# EAGLE design fridge (EAGLE 7.7.0)
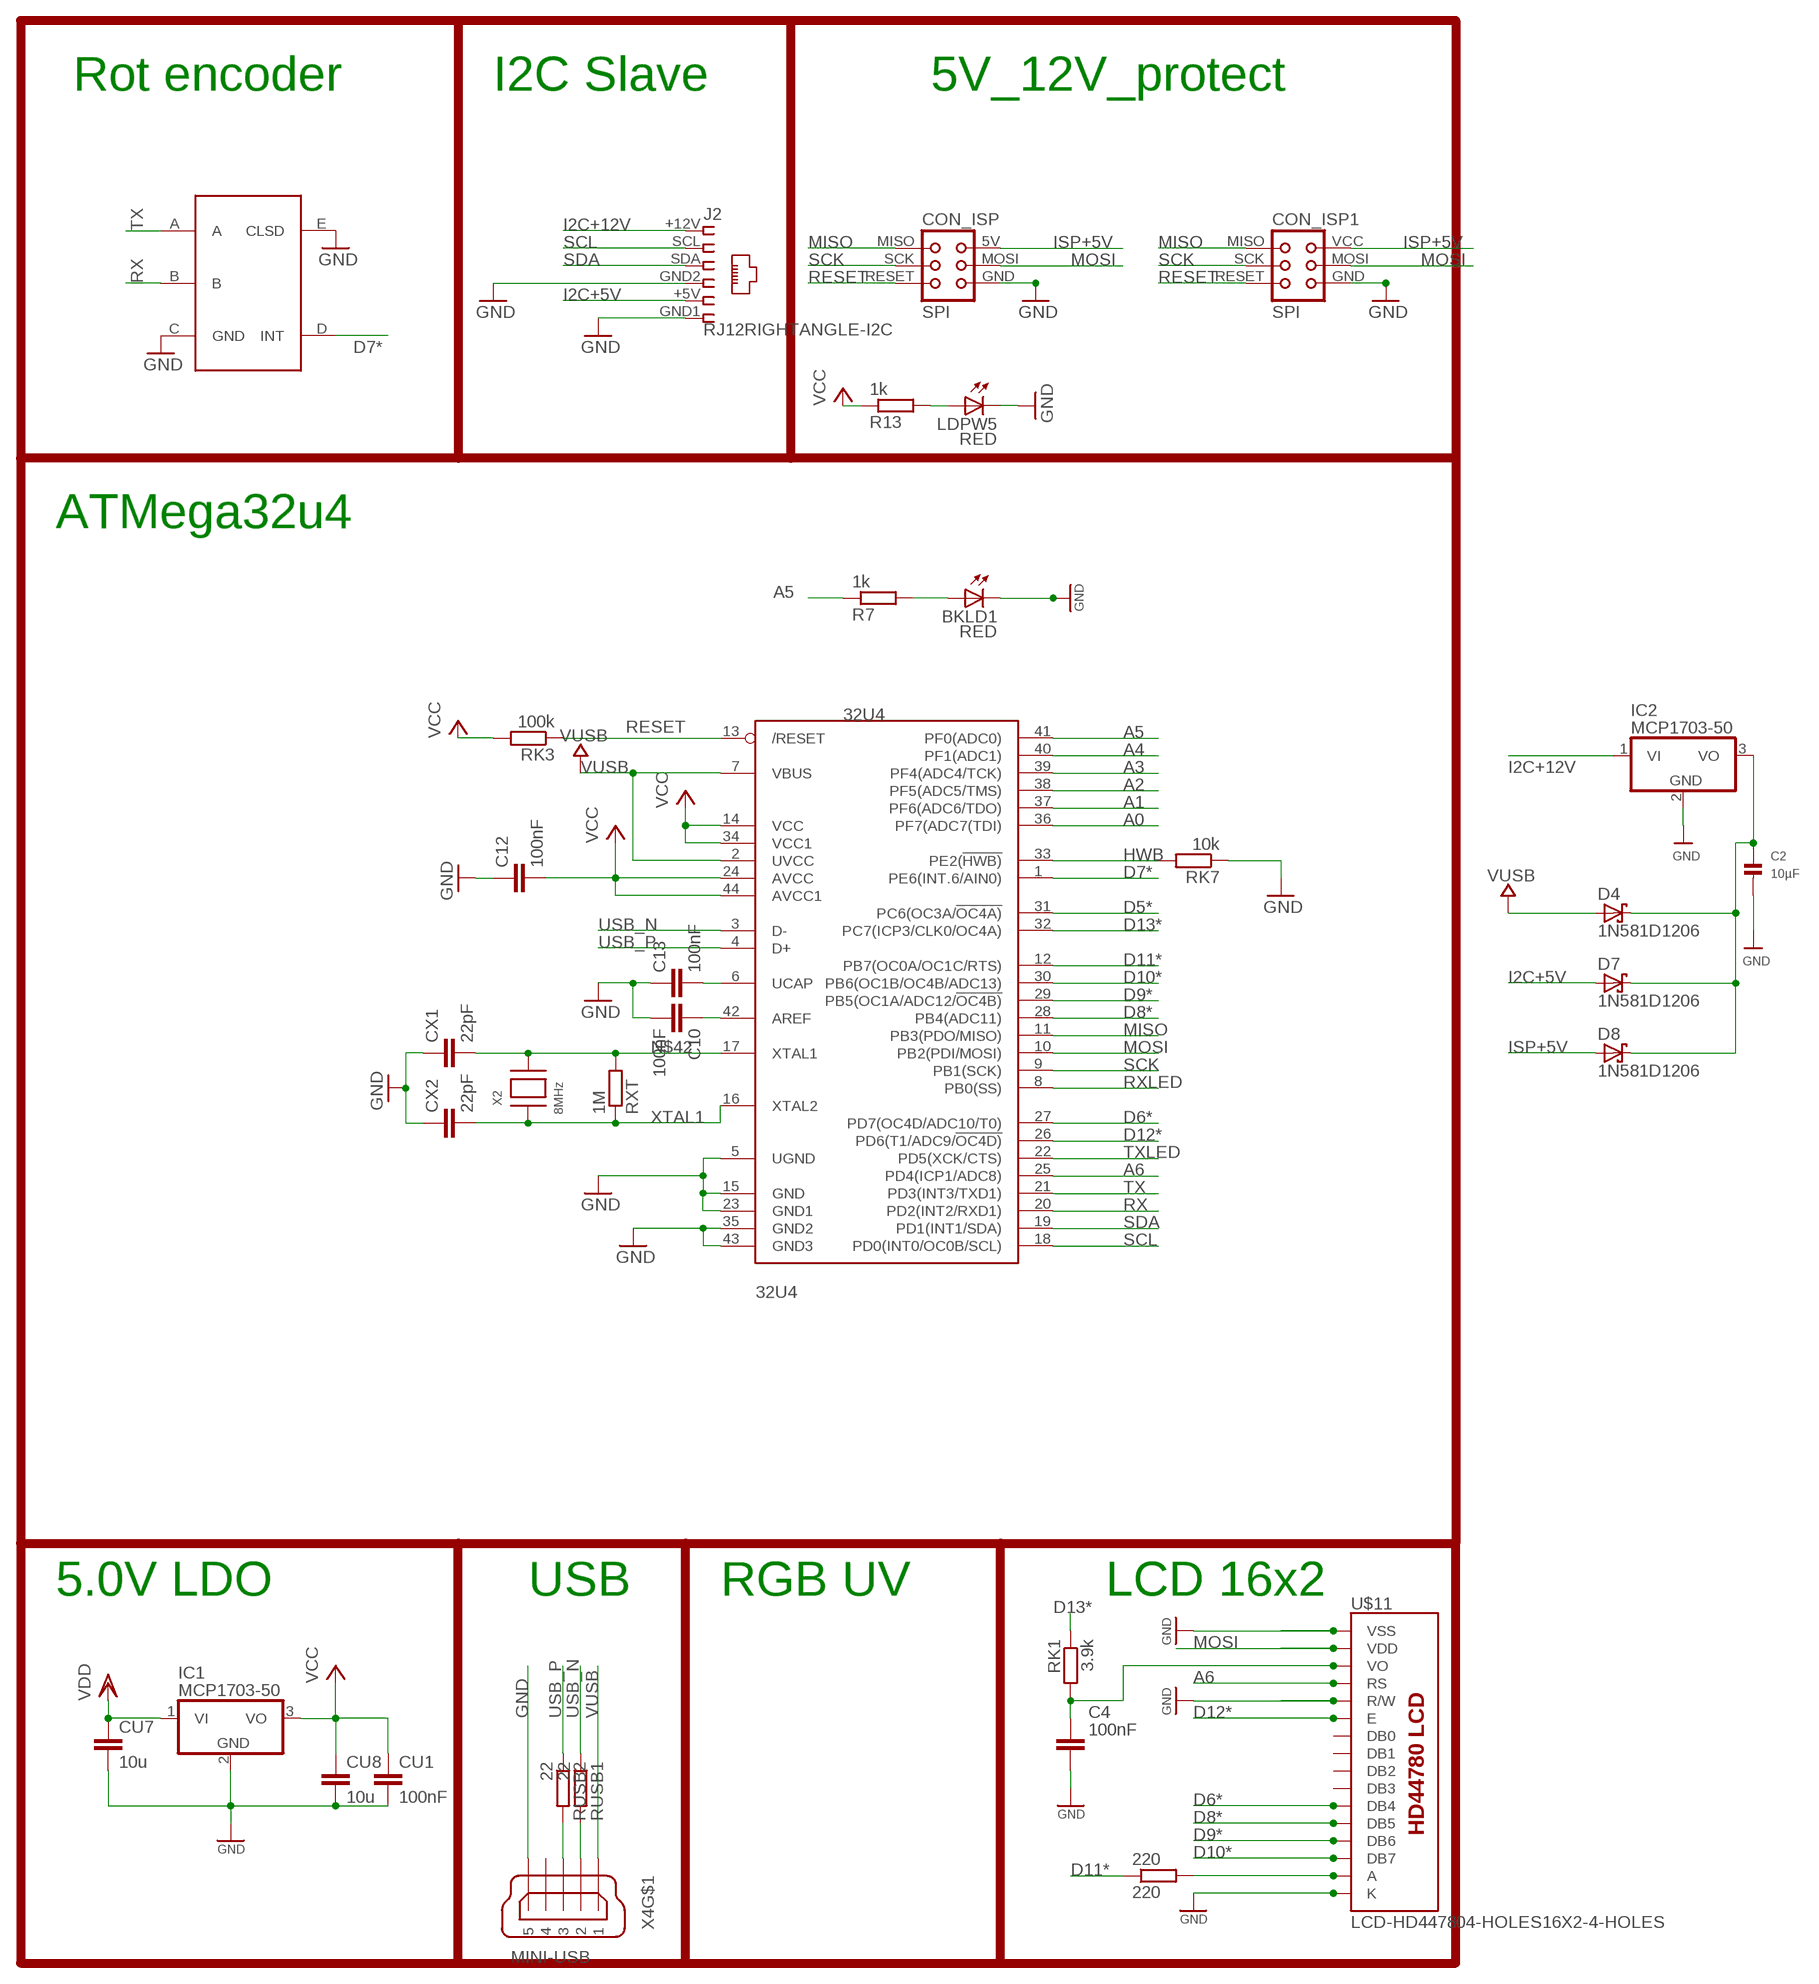
[diagram p0: schematic, sheet 1]

## Parts
32U4  32U4  ATMEGA32U4-AU  [TQFP44]
220  220  R-EU_R0805  [R0805]
BKLD1  RED  LEDCHIP-LED0805  [CHIP-LED0805]
C2  10µF  CAP_CERAMIC0805  [0805]
C4  100nF  CAPACITOR_NPOL-0805  [C805]
C10  100nF  C-EUC1206  [C1206]
C12  100nF  C-EUC1206  [C1206]
C13  100nF  C-EUC1206  [C1206]
CON_ISP  SPI  TINYISPT  [TC2030-MCP-NL]
CON_ISP1  SPI  TINYISP  [TINYISP]
CU1  100nF  C-EUC0805  [C0805]
CU7  10u  C-EUC0805  [C0805]
CU8  10u  C-EUC0805  [C0805]
CX1  22pF  C-EUC1206  [C1206]
CX2  22pF  C-EUC1206  [C1206]
D4  1N581D1206  [LED-1206]
D7  1N581D1206  [LED-1206]
D8  1N581D1206  [LED-1206]
IC1  MCP1703-50  MCP1703DB  [SOT223]
IC2  MCP1703-50  MCP1703DB  [SOT223]
J2  RJ12RIGHTANGLE-I2C  [RJ12-RIGHTANGLE-I2C]
LDPW5  RED  LEDCHIP-LED0805  [CHIP-LED0805]
R7  1k  R-EU_R0805  [R0805]
R13  1k  R-EU_R0805  [R0805]
RK1  3.9k  R-EU_R0805  [R0805]
RK3  100k  R-EU_M0805  [M0805]
RK7  10k  R-EU_M0805  [M0805]
RUSB1  22  R-EU_M1206  [M1206]
RUSB2  22  R-EU_M1206  [M1206]
RXT  1M  R-EU_R0805  [R0805]
U$1  EC11E  [EC11E]
U$11  LCD-HD447804-HOLES16X2-4-HOLES  [LCD-16X2-4HOLES]
X2  8MHz  XTALNX6035  [NX6035]
X4  MINI-USB  MINI-USB-SCHIELD-32005-201  [32005-201]

## Nets
A0: 32U4.36(PF7(ADC7(TDI))
A1: 32U4.37(PF6(ADC6/TDO))
A2: 32U4.38(PF5(ADC5/TMS))
A3: 32U4.39(PF4(ADC4/TCK))
A4: 32U4.40(PF1(ADC1))
A5: 32U4.41(PF0(ADC0)) R7.1
A6: 32U4.25(PD4(ICP1/ADC8)) U$11.4(RS)
AREF: 32U4.42(AREF) C10.1
D5*: 32U4.31(PC6(OC3A/!OC4A))
D6*: 32U4.27(PD7(OC4D/ADC10/T0)) U$11.11(DB4)
D7*: 32U4.1(PE6(INT.6/AIN0)) U$1.D(INT)
D8*: 32U4.28(PB4(ADC11)) U$11.12(DB5)
D9*: 32U4.29(PB5(OC1A/ADC12/!OC4B)) U$11.13(DB6)
D10*: 32U4.30(PB6(OC1B/OC4B/ADC13)) U$11.14(DB7)
D11*: 32U4.12(PB7(OC0A/OC1C/RTS)) 220.1
D12*: 32U4.26(PD6(T1/ADC9/!OC4D)) U$11.6(E)
D13*: 32U4.32(PC7(ICP3/CLK0/OC4A)) RK1.1
GND [power]: 32U4.5(UGND) 32U4.15(GND) 32U4.23(GND1) 32U4.35(GND2) 32U4.43(GND3) BKLD1.C C2.2 C4.2 C10.2 C12.1 C13.1 CON_ISP1.GND CON_ISP.GND CU1.2 CU7.2 CU8.2 CX1.1 CX2.1 IC1.2(GND) IC2.2(GND) J2.GND1 J2.GND2 LDPW5.C RK7.1 U$1.C(GND) U$1.E(CLSD) U$11.1(VSS) U$11.5(R/W) U$11.16(K) X4.5
HWB: 32U4.33(PE2(!HWB)) RK7.2
I2C+5V: D7.A J2.+5V
I2C+12V [power]: IC2.1(VI) J2.+12V
ISP+5V: CON_ISP1.VCC CON_ISP.5V(VCC) D8.A
MISO: 32U4.11(PB3(PDO/MISO)) CON_ISP1.MISO CON_ISP.MISO
MOSI: 32U4.10(PB2(PDI/MOSI)) CON_ISP1.MOSI CON_ISP.MOSI U$11.2(VDD)
N$1: 32U4.6(UCAP) C13.2
N$2: C4.1 RK1.2 U$11.3(VO)
N$11: 220.2 U$11.15(A)
N$12: LDPW5.A R13.2
N$14: BKLD1.A R7.2
N$19: C2.1 D4.C D7.C D8.C IC2.3(VO)
N$42: 32U4.17(XTAL1) CX1.2 RXT.2 X2.P$2
RESET: 32U4.13(/RESET) CON_ISP1.RESET CON_ISP.RESET RK3.1
RX: 32U4.20(PD2(INT2/RXD1)) U$1.B
RXLED: 32U4.8(PB0(SS))
SCK: 32U4.9(PB1(SCK)) CON_ISP1.SCK CON_ISP.SCK
SCL: 32U4.18(PD0(INT0/OC0B/SCL)) J2.SCL
SDA: 32U4.19(PD1(INT1/SDA)) J2.SDA
TX: 32U4.21(PD3(INT3/TXD1)) U$1.A
TXLED: 32U4.22(PD5(XCK/CTS))
USB_N: 32U4.3(D-) RUSB1.1
USB_P: 32U4.4(D+) RUSB2.1
USBC_N: RUSB1.2 X4.2
USBC_P: RUSB2.2 X4.3
VCC: 32U4.14(VCC) 32U4.24(AVCC) 32U4.34(VCC1) 32U4.44(AVCC1) C12.2 CU1.1 CU8.1 IC1.3(VO) R13.1 RK3.2
VDD [power]: CU7.1 IC1.1(VI)
VUSB: 32U4.2(UVCC) 32U4.7(VBUS) D4.A X4.1
XTAL1: 32U4.16(XTAL2) CX2.2 RXT.1 X2.P$1
Unconnected: U$11.7(DB0) U$11.8(DB1) U$11.9(DB2) U$11.10(DB3) X4.4 X4.M1(S:S1) X4.M2(S:S2) X4.M3(S:S3) X4.M4(S:S4)

## Notes on the sheet
- Rot encoder | I2C Slave | 5V_12V_protect
- ATMega32u4
- 5.0V LDO | USB | RGB UV | LCD 16x2

## Library data of the parts
32U4 = adafruit:ATMEGA32U4: http://www.ladyada.net/library/eagle
220 R7 RK1 RXT = rcl:R-EU_: RESISTOR, European symbol
BKLD1 LDPW5 = adafruit:LED: LED OSRAM: - CHIPLED LG R971, LG N971, LY N971, LG Q971, LY Q971, LO R971, LY R971 LH N974, LH R974 LS Q976, LO Q976, LY Q976 LO Q996 - Hyper CHIPLED LW Q18S LB Q993, LB Q99A, LB R99A - SideLED LS A670, LO A670, LY A670, LG A670, LP A670 LB A673, LV A673, LT A673, LW A673 LH A674 LY A675 LS A676, LA A676, LO A676, LY A676, LW A676 LS A679, LY A679, LG A679 - Hyper Micro SIDELED® LS Y876, LA Y876, LO Y876, LY Y876 LT Y87S - SmartLED LW L88C, LW L88S LB L89C, LB L89S, LG L890 LS L89K, LO L89K, LY L89K LS L896, LA L896, LO L896, LY L896 - TOPLED LS T670, LO T670, LY T670, LG T670, LP T670 LSG T670, LSP T670, LSY T670, LOP T670, LYG T670 LG T671, LOG T671, LSG T671 LB T673, LV T673, LT T673, LW T673 LH T674 LS T676, LA T676, LO T676, LY T676, LB T676, LH T676, LSB T676, LW T676 LB T67C, LV T67C, LT T67C, LS T67K, LO T67K, LY T67K, LW E67C LS E67B, LA E67B, LO E67B, LY E67B, LB E67C, LV E67C, LT E67C LW T67C LS T679, LY T679, LG T679 LS T770, LO T770, LY T770, LG T770, LP T770 LB T773, LV T773, LT T773, LW T773 LH T774 LS E675, LA E675, LY E675, LS T675 LS T776, LA T776, LO T776, LY T776, LB T776 LHGB T686 LT T68C, LB T68C - Hyper Mini TOPLED® LB M676 - Mini TOPLED Santana® LG M470 LS M47K, LO M47K, LY M47K Source: http://www.osram.convergy.de/
C2 = microbuilder:CAP_CERAMIC: Ceramic Capacitors 0402 - 0402 Surface Mount Capacitors 16pF 50V 5% [Digikey: 445-4899-2-ND] 18pF 50V 5% [Digikey: 490-1281-2-ND] 22pF 50V 5% [Digikey: 490-1283-2-ND] 68pF 50V 5% [Digikey: 490-1289-2-ND] 0.1uF 10V 10% [Digikey: 490-1318-2-ND] 1.0uF 6.3V 10% [Digikey: 490-1320-2-ND] 0603 - 0603 Surface Mount Capacitors 16 pF 50V 5% [Digikey: 445-5051-2-ND] 22 pF 50V [Digikey: PCC220ACVTR-ND] 33 pF 50V 5% [Digikey: 490-1415-1-ND] 56pF 50V 5% [Digikey: 490-1421-1-ND] 220pF 50V 5% [Digikey: 445-1285-1-ND] 680 pF 50V 2200 pF 50V 5% C0G [Digikey: 445-1297-1-ND] 5600 pF 100V 5% X7R [Digikey: 478-3711-1-ND] 0.1 µF 25V 10% [Digikey: PCC2277TR-ND] 0.22 µF 16V 10% X7R [Digikey: 445-1318-1-ND] 1.0 µF 25V 10% [Digikey: 445-5146-2-ND] 0603 - RF Specific 3pF 250V +/-0.1pF RF [Digikey: 712-1347-1-ND] 18 pF 250V 5% [Digikey: 478-3505-1-ND or 712-1322-1-ND] 56 pF 250V 5% C0G RF [Digikey: 490-4867-1-ND] 68 pF 250V RF [Digikey: 490-4868-1-ND] 0805 - 0805 Surface Mount Capacitors 220 pF 250V 2% RF Ceramic Capacitor [Digikey: 712-1398-1-ND] 1000 pF 50V 2% NP0 Ceramic Capacitor [Digikey: 478-3760-1-ND] 0.1 µF 25V 10% Ceramic Capacitor [Digikey: PCC1828TR-ND] 1.0 µF 16V 10% Ceramic Capacitor[Digikey: 490-1691-2-ND] 10.0 µF 10V 10% Ceramic Capacitor[Digikey: 709-1228-1-ND] 10.0 uF 16V 10% Ceramic Capacitor [Digikey: 478-5165-2-ND] 47 uF 6.3V 20% Ceramic Capacitor [Digikey: 587-1779-1-ND or 399-5506-1-ND] 1206 - 1206 Surface Mount Capacitors 47uF 10V 20% Ceramic Capacitor [Digikey: 490-5528-1-ND or 399-5508-1-ND or 445-6010-1-ND] 100uF 6.3V -20%, +80% Y5V Ceramic Capacitor (Digikey: 490-4512-1-ND, Mouser: 81-GRM31CF50J107ZE1L)
C4 = dp_devices:CAPACITOR_NPOL: Non-Polarized capacitor in various packages
C10 C12 C13 CU1 CU7 CU8 CX1 CX2 = rcl:C-EU: CAPACITOR, European symbol
CON_ISP = lpatiny:TINYISP: CONNECTOR
CON_ISP1 = lpatiny:TINYISP: CONNECTOR; OC_FARNELL: unknown; OC_NEWARK: unknown
D4 D7 D8 = lpatiny:1N581*: 1.0A SCHOTTKY BARRIER RECTIFIER Source: http://www.diodes.com/datasheets/ds23001.pdf
IC1 IC2 = linear:MCP1703: 250 mA, 16V, Low Quiescent Current LDO Regulator Source: http://ww1.microchip.com/downloads/en/DeviceDoc/22049b.pdf
J2 = lpatiny:RJ12: CORCOM Modular RJ Jacks No Shield Source: www.tycoelectronics.com .. ENG_DS_1654001_1099_RJ_L_0507.pdf
R13 RK3 RK7 RUSB1 RUSB2 = resistor:R-EU_: RESISTOR, European symbol
U$1 = lpatiny:EC11E: ALPS Rotary encoder
U$11 = HD44780LCD:LCD-HD44780
X2 = lpatiny:XTAL: Low cost SMT crystals, no capacitors included http://www.ladyada.net/library/eagle
X4 = con-cypressindustries:MINI-USB-SCHIELD-: MINI USB-B Conector Source: www.cypressindustries.com; OC_FARNELL: unknown; OC_NEWARK: unknown

## Net classes
0 default: width 0.406 mm, clearance 0.25 mm
1 power: width 0.406 mm, drill 0.305 mm, clearance 0.25 mm
2 VIN: width 0.406 mm, clearance 0.25 mm
3 fine: width 0.406 mm, clearance 0.25 mm
4 aref: width 0.406 mm, clearance 0.25 mm

## Board
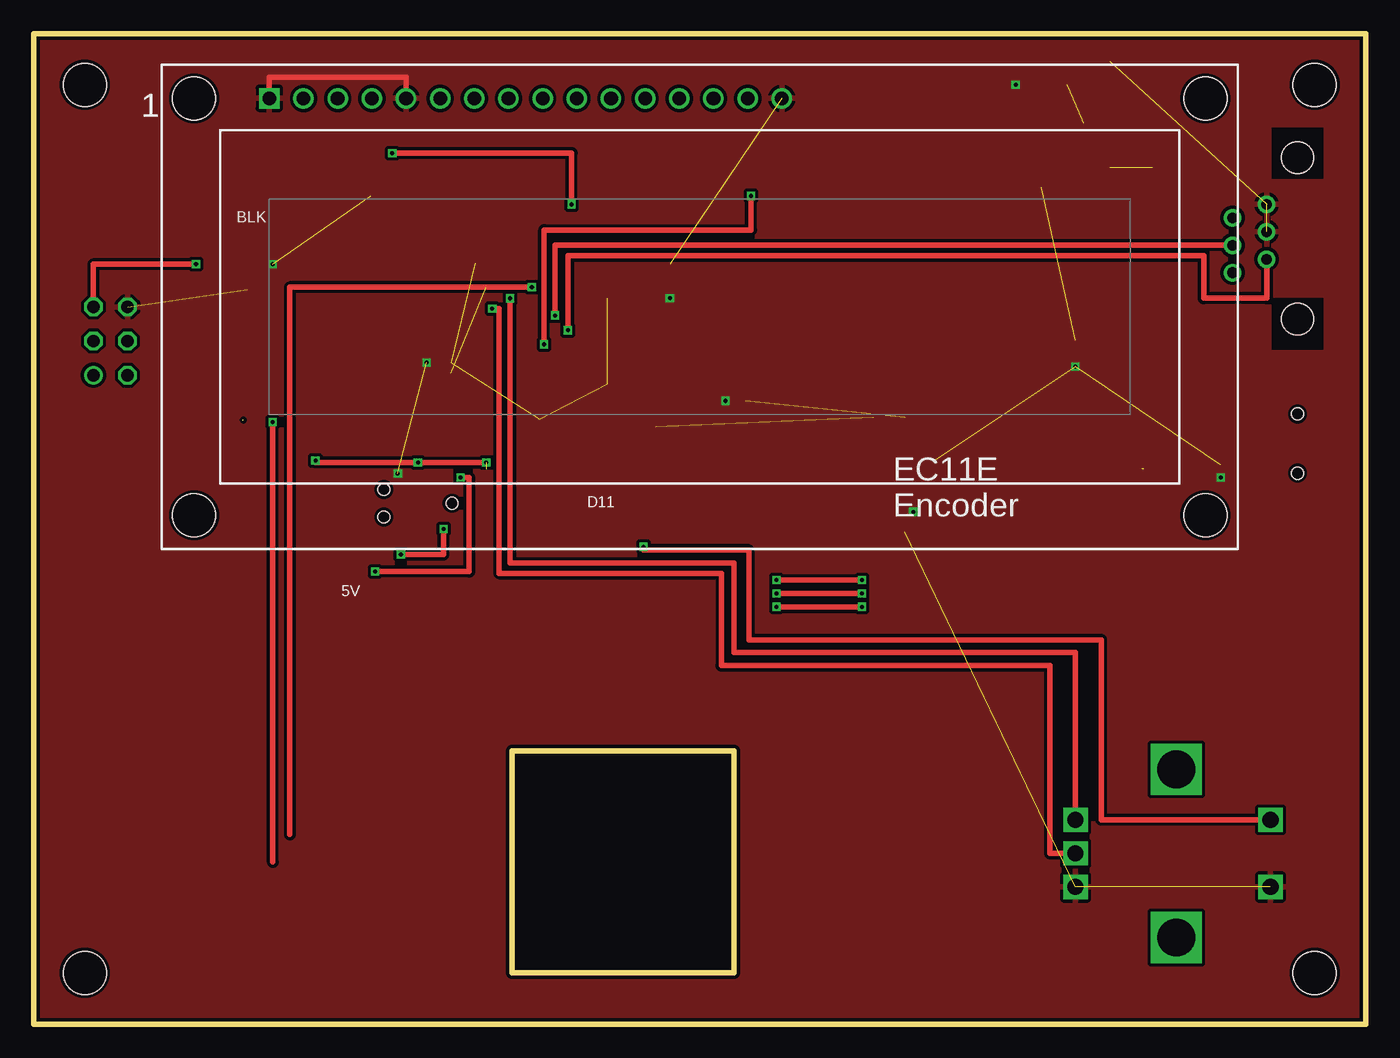
[diagram p1: board, top side]
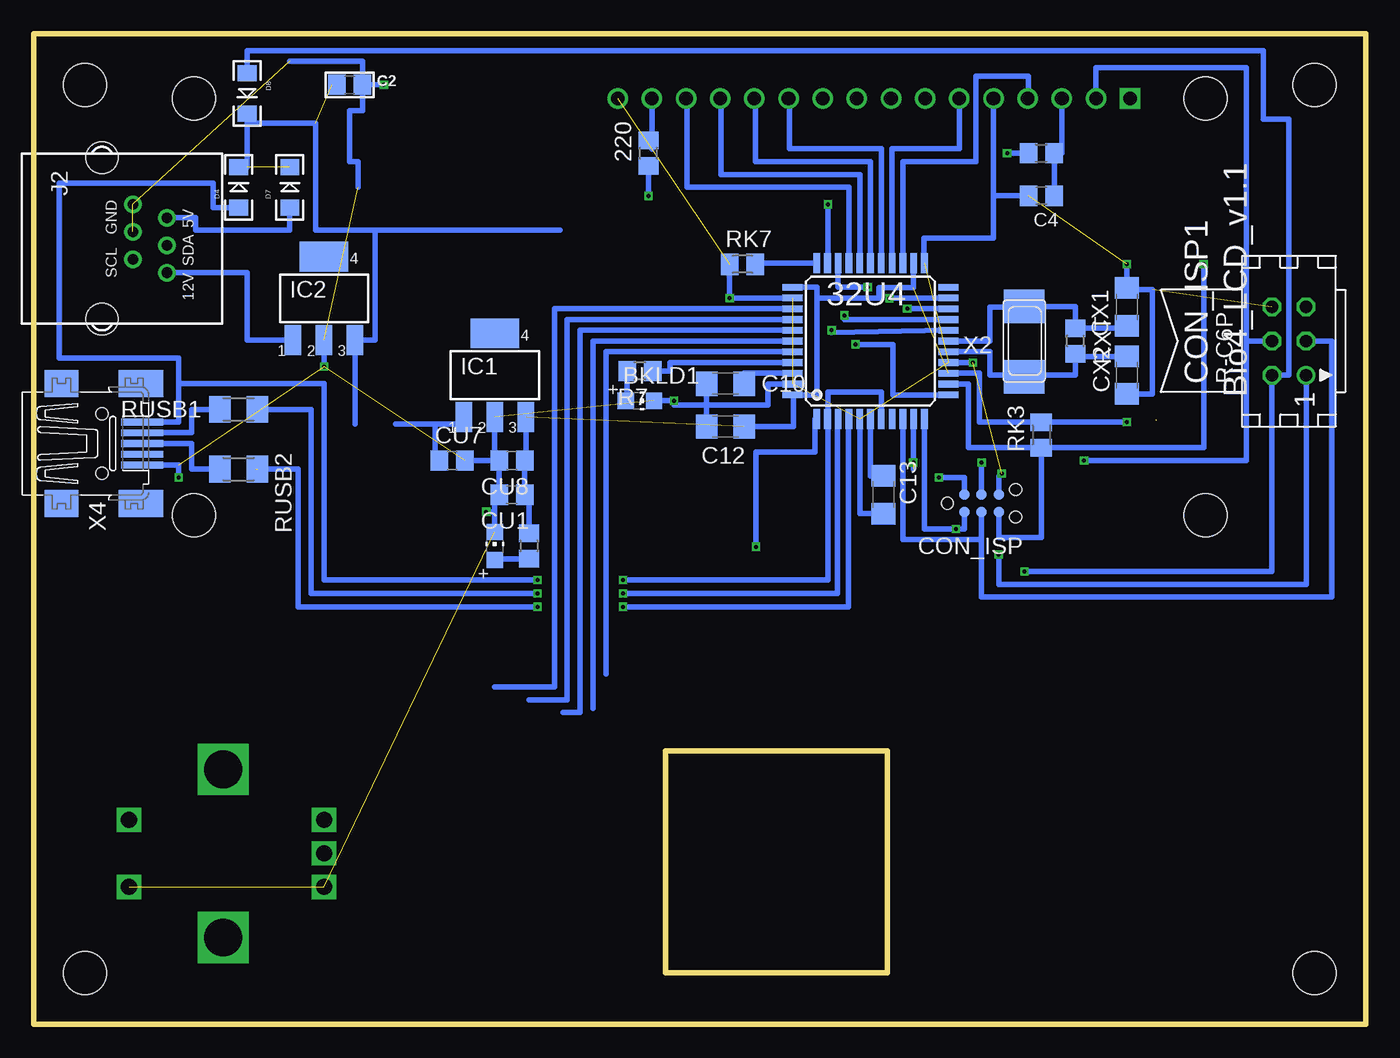
[diagram p2: board, bottom side, seen from below]

Size 99.06 x 73.66 mm. Coordinates in mm from the lower left corner, seen from the top.
Outline: 15.59,44.9 15.58,44.94
Outline: 0,73.66 0,0 99.06,0 99.06,73.66 0,73.66
Outline: 35.56,20.32 52.07,20.32 52.07,3.81 35.56,3.81 35.56,20.32
Copper layers (1*2*15*16): Top 0.035mm / dielectric 0.2mm / layer 2 0.0175mm / dielectric 1.1mm / layer 15 0.0175mm / dielectric 0.2mm / Bottom 0.035mm
Design rules "SeeedStudio_DRU_no_angle_20130527": minimum track width 6mil, minimum drill 12mil, track to track 6mil, track to pad 6mil, pad to pad 6mil, via to via 6mil, smd to smd 0mil, copper to edge 10mil, drill to drill 10mil, minimum pad ring 6mil, minimum via ring 6mil, stop-mask expansion 2mil, vias tented up to drill 25mil, thermal gap 10mil
Holes 3.2 mm at 3.81,69.85 3.81,3.81 95.25,69.85 95.25,3.81

### Footprints (pad centres in the part's own frame; a part is rotated, then mirrored left to right if it is on the bottom)
TQFP44 = smd 1.5 x 0.5: 1 -5.8,4; 2 -5.8,3.2; 3 -5.8,2.4; 4 -5.8,1.6; 5 -5.8,0.8; 6 -5.8,0; 7 -5.8,-0.8; 8 -5.8,-1.6; 9 -5.8,-2.4; 10 -5.8,-3.2; 11 -5.8,-4; 23 5.8,-4; 24 5.8,-3.2; 25 5.8,-2.4; 26 5.8,-1.6; 27 5.8,-0.8; 28 5.8,0; 29 5.8,0.8; 30 5.8,1.6; 31 5.8,2.4; 32 5.8,3.2; 33 5.8,4 | smd 0.5 x 1.5: 12 -4,-5.8; 13 -3.2,-5.8; 14 -2.4,-5.8; 15 -1.6,-5.8; 16 -0.8,-5.8; 17 0,-5.8; 18 0.8,-5.8; 19 1.6,-5.8; 20 2.4,-5.8; 21 3.2,-5.8; 22 4,-5.8; 34 4,5.8; 35 3.2,5.8; 36 2.4,5.8; 37 1.6,5.8; 38 0.8,5.8; 39 0,5.8; 40 -0.8,5.8; 41 -1.6,5.8; 42 -2.4,5.8; 43 -3.2,5.8; 44 -4,5.8
R0805 = smd 1.3 x 1.5: 1 -0.95,0; 2 0.95,0
CHIP-LED0805 = smd 1.2 x 1.2: A 0,-1.05; C 0,1.05
0805 = smd 1.3 x 1.5: 1 -0.95,0; 2 0.95,0
C805 = smd 1.3 x 1.5: 1 -0.95,0; 2 0.95,0
C1206 = smd 1.6 x 1.8: 1 -1.4,0; 2 1.4,0
TC2030-MCP-NL = smd 0.787 x 0.787: 5V 1.27,0.635; GND 3.81,0.635; MISO 1.27,-0.635; MOSI 2.54,0.635; RESET 3.81,-0.635; SCK 2.54,-0.635 | hole 0.889: 0,0; 5.08,-1.016; 5.08,1.016
TINYISP = drill 0.914 octagon: GND 2.54,1.27; MOSI 0,1.27; RESET 2.54,-1.27; SCK 0,-1.27; VCC -2.54,1.27 | drill 0.914: MISO -2.54,-1.27
C0805 = smd 1.3 x 1.5: 1 -0.95,0; 2 0.95,0
LED-1206 = smd 1.2 x 1.4: A -1.5,0; C 1.5,0
SOT223 = smd 1.219 x 2.235: 1 -2.311,-3.099; 2 0,-3.099; 3 2.311,-3.099 | smd 3.6 x 2.2: 4 0,3.099
RJ12-RIGHTANGLE-I2C = drill 0.8 pad 1.3: +5V -1.54,4.84; +12V 2.54,4.84; GND1 -2.54,2.3; GND2 -0.5,2.3; SCL 1.54,2.3; SDA 0.5,4.84 | hole 2.36: -6,0; 6,0
M0805 = smd 1.3 x 1.6: 1 -0.95,0; 2 0.95,0
M1206 = smd 1.6 x 2: 1 -1.4,0; 2 1.4,0
EC11E = drill 1.2 square: A -2.5,0; B 0,0; C 2.5,0; D -2.5,14.5; E 2.5,14.5 | drill 2.8 square: P$1 6.25,7.5; P$2 -6.25,7.5
LCD-16X2-4HOLES = drill 1.016 square: 1 -32,15.5 | drill 1.016: 2 -29.46,15.5; 3 -26.92,15.5; 4 -24.38,15.5; 5 -21.84,15.5; 6 -19.3,15.5; 7 -16.76,15.5; 8 -14.22,15.5; 9 -11.68,15.5; 10 -9.14,15.5; 11 -6.6,15.5; 12 -4.06,15.5; 13 -1.52,15.5; 14 1.02,15.5; 15 3.56,15.5; 16 6.1,15.5 | hole 3.2: -37.6,15.5; -37.6,-15.5; 37.6,-15.5; 37.6,15.5
NX6035 = smd 2.5 x 3: P$1 2.665,0; P$2 -2.565,0
32005-201 = smd 3.1 x 0.5: 1 3,1.6; 2 3,0.8; 3 3,0; 4 3,-0.8; 5 3,-1.6 | smd 2.5 x 2: M1 -3,-4.45; M2 -3,4.45 | smd 3.3 x 2: M3 2.9,4.45; M4 2.9,-4.45 | hole 0.9: 0,2.2; 0,-2.2

### Placement (x,y rotation side)
32U4  36.83,50.8 90 bottom
220  53.34,64.77 90 bottom
BKLD1  53.98,46.35 270 bottom
C2  75.56,69.85 0 bottom
C4  24.13,61.59 180 bottom
C10  47.62,47.62 180 bottom
C12  47.62,44.45 0 bottom
C13  35.88,39.37 90 bottom
CON_ISP  31.11,38.73 0 bottom
CON_ISP1  5.71,50.8 90 bottom
CU1  63.5,39.37 180 bottom
CU7  67.94,41.91 0 bottom
CU8  63.5,41.91 180 bottom
CX1  17.78,53.34 270 bottom
CX2  17.78,48.26 90 bottom
D4  83.82,62.23 90 bottom
D7  80.01,62.23 90 bottom
D8  83.19,69.22 270 bottom
IC1  64.77,48.26 0 bottom
IC2  77.47,53.98 0 bottom
J2  93.98,58.42 270 bottom
LDPW5  64.77,35.56 0 bottom
R7  53.98,48.56 180 bottom
R13  62.23,35.56 270 bottom
RK1  24.13,64.77 0 bottom
RK3  24.13,43.81 90 bottom
RK7  46.35,56.52 0 bottom
RUSB1  83.82,45.72 180 bottom
RUSB2  83.82,41.27 180 bottom
RXT  21.59,50.8 90 bottom
U$1  77.47,12.7 270 top
U$11  49.53,53.34 0 top
X2  25.4,50.8 270 bottom
X4  93.98,43.18 0 bottom

### Tracks (layer width: path | path; a pad name or v marks a point on that pad's centre or on a via)
A0
  Bottom 0.406: 32U4.36 60.33,53.2 60.33,25.07 64.77,25.07
A1
  Bottom 0.406: 32U4.37 59.41,52.4 59.41,24.13 62.23,24.13
A2
  Bottom 0.406: 32U4.38 58.42,51.6 58.42,23.19 59.69,23.19
A3
  Bottom 0.406: 32U4.39 57.48,50.8 57.48,23.5
A4
  Bottom 0.406: 42.63,50.04 32U4.40 56.52,50 56.52,26.04
A5
  Bottom 0.406: R7.1 51.75,48.56 51.75,49.21 42.63,49.21 32U4.41
A6
  Bottom 0.406: U$11.4 25.08,68.84 25.08,70.48 29,70.48 29,64.14 34.43,64.14 32U4.25
AREF
  Bottom 0.406: 32U4.42 46.23,48.4 C10.1
D5*  (via drill 0.3)
  Top 0.406: v37.05,54.8 19.05,54.8 19.05,14.1
  Bottom 0.406: 32U4.31 39.24,56.6 39.24,54.8 v37.05,54.8
D6*
  Bottom 0.406: U$11.11 42.86,68.84 42.86,65.09 36.03,65.09 32U4.27
D7*  (via drill 0.3)
  Top 0.406: U$1.D 79.38,15.2 79.38,28.57 53.17,28.57 53.17,35.26 45.34,35.26 v45.34,35.5
  Bottom 0.406: 32U4.1 40.96,45 40.96,42.55 45.34,42.55 v45.34,35.5 | 91.97,14.93 U$1.D
D8*
  Bottom 0.406: U$11.12 45.4,68.84 45.4,64.14 36.83,64.14 32U4.28
D9*
  Bottom 0.406: U$11.13 47.94,68.84 47.94,63.18 37.63,63.18 32U4.29
D10*
  Bottom 0.406: U$11.14 50.48,68.84 50.48,62.23 38.43,62.23 32U4.30
D11*  (via drill 0.3)
  Top 0.406: v37.96,50.55 37.96,59.05 53.34,59.05 v53.34,61.59
  Bottom 0.406: 32U4.12 | 32U4.12 35.18,46.8 35.18,50.55 v37.96,50.55 | v53.34,61.59 220.1
D12*
  Bottom 0.406: 32U4.26 35.24,56.6 35.24,65.09 30.23,65.09 U$11.6
D13*  (via drill 0.3)
  Top 0.406: v40.01,60.96 40.01,64.77 v26.67,64.77
  Bottom 0.406: 32U4.32 40.01,56.6 v40.01,60.96 | v26.67,64.77 RK1.1
GND  (via drill 0.3)  (16 unrouted)
  Top 0.406: U$11.1 17.53,70.42 27.69,70.42 U$11.5
  Bottom 0.406: CX2.1 15.88,46.86 15.88,54.61 17.78,54.61 CX1.1 v17.78,56.52 | 49.02,47.6 C10.2 49.02,46.04 | 49.02,46.04 C12.1 | 32U4.43 44.45,47.6 44.45,46.04 49.02,46.04 | BKLD1.C v51.44,46.35 51.44,46.04 49.02,46.04 | C13.1 37.63,37.97 32U4.5 | C4.2 27.69,61.59 | 27.69,61.59 U$11.5 | 74.93,62.23 74.93,64.14 75.56,64.14 75.56,66.04 75.56,67.94 74.61,67.94 C2.2 | IC1.2 64.77,41.91 CU8.2 | CU8.2 CU1.2 64.77,39.37 64.77,38.1 | 64.77,38.1 LDPW5.C | 91.68,58.9 J2.GND2 | 80.01,71.59 74.61,71.59 C2.2 | C2.2 v73.03,69.85 | CU7.2 CU8.2 | IC2.2 v77.47,48.9 | X4.5 88.27,41.58 v88.27,40.64 | 32U4.35 v47.3,54 RK7.1 | 64.77,38.1 v65.41,38.1 | 32U4.15 v29.22,49.2 | v29.22,49.2 | 32U4.23 32.85,56.6 32.85,58.45 27.69,58.45 27.69,61.59 | CON_ISP.GND 27.3,40.72 v27.08,40.95
  pour Top: 0,73.66 0,0 99.06,0 99.06,73.66
HWB
  Bottom 0.406: 32U4.33 45.41,56.6 RK7.2
I2C+5V
  Bottom 0.406: D7.A 80.01,59.05 87,59.05 87,59.96 J2.+5V
I2C+12V
  Bottom 0.406: J2.+12V 83.19,55.88 83.19,50.88 IC2.1
ISP+5V  (via drill 0.3)
  Top 0.406: v31.75,40.64 32.38,40.64 32.38,33.66 v25.4,33.66
  Bottom 0.406: CON_ISP.5V 29.84,40.64 v31.75,40.64 | D8.A 83.19,72.39 7.62,72.39 7.62,67.31 5.71,67.31 5.71,48.26 CON_ISP1.VCC 6.99,33.66 v25.4,33.66
MISO  (via drill 0.3)
  Top 0.406: v27.3,34.92 30.48,34.92 v30.48,36.83
  Bottom 0.406: CON_ISP.MISO 29.84,36.83 v30.48,36.83 32.83,36.83 32U4.11 | CON_ISP1.MISO 4.45,32.69 27.3,32.69 v27.3,34.92
MOSI  (via drill 0.3)  (1 unrouted)
  Top 0.406: v33.66,41.77 v28.57,41.77 20.95,41.77 v20.95,41.91
  Bottom 0.406: CON_ISP.MOSI v28.57,41.77 | 33.63,41.27 32U4.10 | CON_ISP1.MOSI 8.89,50.8 | 8.89,50.8 8.89,71.12 20.07,71.12 U$11.2 | v20.95,41.91 8.89,41.91 8.89,50.8
N$1
  Bottom 0.406: C13.2 36.83,40.77 32U4.6
N$2
  Bottom 0.406: C4.1 RK1.2 22.61,64.77 U$11.3
N$11
  Bottom 0.406: U$11.15 53.09,65.08 220.2
N$12
  Bottom 0.406: R13.2 64.77,34.61 LDPW5.A
N$14
  Bottom 0.406: BKLD1.A 54.92,46.35 R7.2
N$19  (2 unrouted)
  Bottom 0.406: C2.1 76.86,69.85 | 73.66,59.05 73.66,50.88 IC2.3 75.16,44.62 | 73.66,59.05 78.11,59.05 78.11,66.99 80.01,66.99 83.19,66.99 D8.C 83.19,63.73 D4.C | 73.66,59.05 59.91,59.05
N$42
  Bottom 0.406: 32U4.17 27.94,50.8 27.94,53.34 25.4,53.34 X2.P$2 21.59,53.37 RXT.2 17.78,51.75 CX1.2
RESET  (via drill 0.3)
  Top 0.406: v12.06,56.52 4.45,56.52 CON_ISP1.RESET
  Bottom 0.406: 32U4.13 29.54,47.6 29.54,42.87 RK3.1 | CON_ISP.RESET 27.3,36.2 24.13,36.2 RK3.1 | RK3.1 12.06,42.87 v12.06,56.52
RX  (via drill 0.3)
  Top 0.406: v34.1,53.21 34.62,53.21 34.62,33.52 51.13,33.52 51.13,26.67 75.56,26.67 75.56,12.7 U$1.B
  Bottom 0.406: 32U4.20 v34.1,53.2 v34.1,53.21
SCK
  Bottom 0.406: CON_ISP.SCK 28.57,36.03 | 28.57,36.03 34.43,36.03 32U4.9 | CON_ISP1.SCK 2.54,50.8 2.54,31.75 28.57,31.75 28.57,36.03
SCL  (via drill 0.3)
  Top 0.406: v39.73,51.6 39.73,57.15 87,57.15 87,53.98 91.68,53.98 J2.SCL
  Bottom 0.406: v39.73,51.6 39.73,51.44 32U4.18
SDA  (via drill 0.3)
  Top 0.406: J2.SDA 38.76,57.92 v38.76,52.7
  Bottom 0.406: v38.76,52.7 38.79,52.4 32U4.19
TX  (via drill 0.3)
  Top 0.406: v35.42,53.98 35.42,34.29 52.07,34.29 52.07,27.64 77.47,27.64 U$1.A
  Bottom 0.406: 32U4.21 v35.42,53.98
USB_N  (via drill 0.3)
  Top 0.406: v55.24,32.03 v61.58,32.03
  Bottom 0.406: 32U4.3 39.29,45 39.29,32.03 v55.24,32.03 | v61.58,32.03 78.42,32.03 78.42,45.72 RUSB1.1
USB_P  (via drill 0.3)  (1 unrouted)
  Top 0.406: v55.24,31.04 v61.58,31.04
  Bottom 0.406: 82.55,41.27 81.92,41.27 | 81.92,41.27 81.92,40.64 | 81.92,41.27 79.38,41.27 79.38,31.04 v61.58,31.04 | 32U4.4 38.47,45 38.47,31.04 v55.24,31.04
USBC_N
  Bottom 0.406: X4.2 87.3,43.98 87.3,45.72 RUSB1.2
USBC_P
  Bottom 0.406: X4.3 87.3,43.18 87.3,41.27 RUSB2.2
VCC  (via drill 0.3)  (2 unrouted)
  Top 0.406: 17.78,12.06 v17.78,44.77
  Bottom 0.406: C12.2 42.55,44.45 42.55,46.8 32U4.44 40.8,46.8 40.8,53.98 | 32U4.14 28.74,48.4 28.74,44.77 RK3.2 v17.78,44.77 | IC1.3 62.46,41.91 CU8.1 CU1.1 62.23,39.37 R13.1 | 40.8,53.98 40.8,54.8 32U4.34 | 32U4.24 33.66,56.6 33.66,54.77 36.22,54.77 36.22,53.98 40.8,53.98
VDD
  Bottom 0.406: 72.16,44.62 69.22,44.62 | 69.22,44.62 67.08,44.62 IC1.1 67.31,45.16 | CU7.1 69.22,41.91 69.22,44.62
VUSB  (via drill 0.3)
  Top 0.406: v55.24,33.02 v61.58,33.02
  Bottom 0.406: 40.01,45 40.01,46.99 36.03,46.99 32U4.7 | 32U4.2 40.01,45 | 40.01,45 40.01,33.02 v55.24,33.02 | v61.58,33.02 77.47,33.02 77.47,47.62 88.27,47.62 | 88.27,47.62 88.27,44.78 X4.1 | 88.27,47.62 88.27,49.53 97.16,49.53 97.16,62.53 85.72,62.53 85.72,60.73 D4.A
XTAL1
  Bottom 0.406: 25.4,48.26 21.59,48.26 RXT.1 21.59,49.66 CX2.2 | 25.4,48.26 X2.P$1 | 25.4,48.26 27.94,48.26 27.94,50 32U4.16

### Text on the board
tNames: 1 | BLK | D11 | EC11E / Encoder | 5V
bNames: Bio4_LCD_v1.1